# Altium schematic sheet DACAmplification.SchDoc: ExtModule-SewingController
size A4
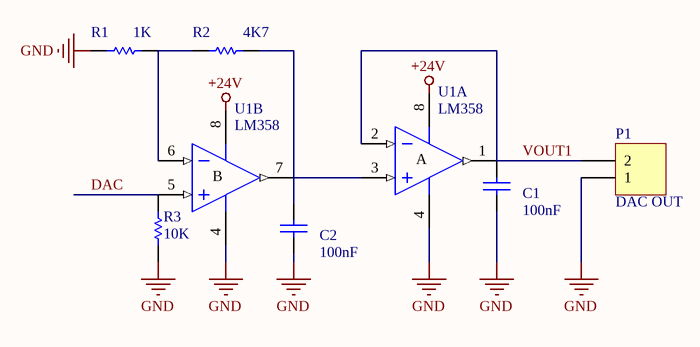
[diagram p0: DACAmplification.SchDoc]

## Parts
C1  value 100nF  [C-0805]  (hidden comment: 104)
C2  value 100nF  [C-0805]  (hidden comment: 104)
P1  value DAC OUT  [TER-KF128-2P]  (hidden comment: KF128-2P)
R1  1K  [R-0805]
R2  4K7  [R-0805]
R3  10K  [R-0805]
U1  LM358  [SK-DIP8-300]  (parts A,B of 2)

## Nets
+24V: U1.8(V+)
GND: C1.1 C2.1 P1.1 R1.1 R3.1 U1.4(V-)
DAC: R3.2 U1.5(IN+)
VOUT1: C1.2 P1.2 U1.1(OUT) U1.2(IN-)
NetC2_2: C2.2 R2.2 U1.3(IN+) U1.7(OUT)
NetR1_2: R1.2 R2.1 U1.6(IN-)

## Notes on the sheet
- (in symbol TL082D, part A) A
- (in symbol TL082D, part B) B

## Library data of the parts
C1 C2 = Cap: Capacitor; Published: 8-Jun-2000; LatestRevisionDate: 17-Jul-2002; LatestRevisionNote: Re-released for DXP Platform.; PackageReference: RAD-0.3; Publisher: Altium Limited; PackageDescription: Radial Cap, Thru-Hole; 2 Leads; 0.3 in Pin Spacing
P1 = Header 2: Header, 2-Pin; LatestRevisionDate: 17-Jul-2002; LatestRevisionNote: Re-released for DXP Platform.
R1-R3 = Res1: Resistor; Published: 8-Jun-2000; LatestRevisionDate: 17-Jul-2002; LatestRevisionNote: Re-released for DXP Platform.; PackageReference: AXIAL-0.3; Publisher: Altium Limited; PackageDescription: Axial Device, Thru-Hole; 2 Leads; 0.3 in Pin Spacing
  R1: Value: 1K
  R2: Value: 4K7
  R3: Value: 10K
U1 = TL082D: JFET-Input Operational Amplifier; Value: TL082; Published: 16-Jan-2001; LatestRevisionDate: 13-Apr-2006; LatestRevisionNote: IPC-7351 Footprint Added.; DatasheetVersion: Feb-1999; PackageVersion: Jan-1998; PackageReference: D008; PackageDescription: 8-Pin Small Outline Integrated Circuit 1.27 mm Pitch; Code_IPC: SOIC127P600-8; ComponentLink1Description: Manufacturer Link; ComponentLink1URL: http://www.ti.com/; ComponentLink2Description: Datasheet; ComponentLink2URL: http://www-s.ti.com/sc/ds/tl082.pdf